# EAGLE design LokomotivRevB (EAGLE 6.4)
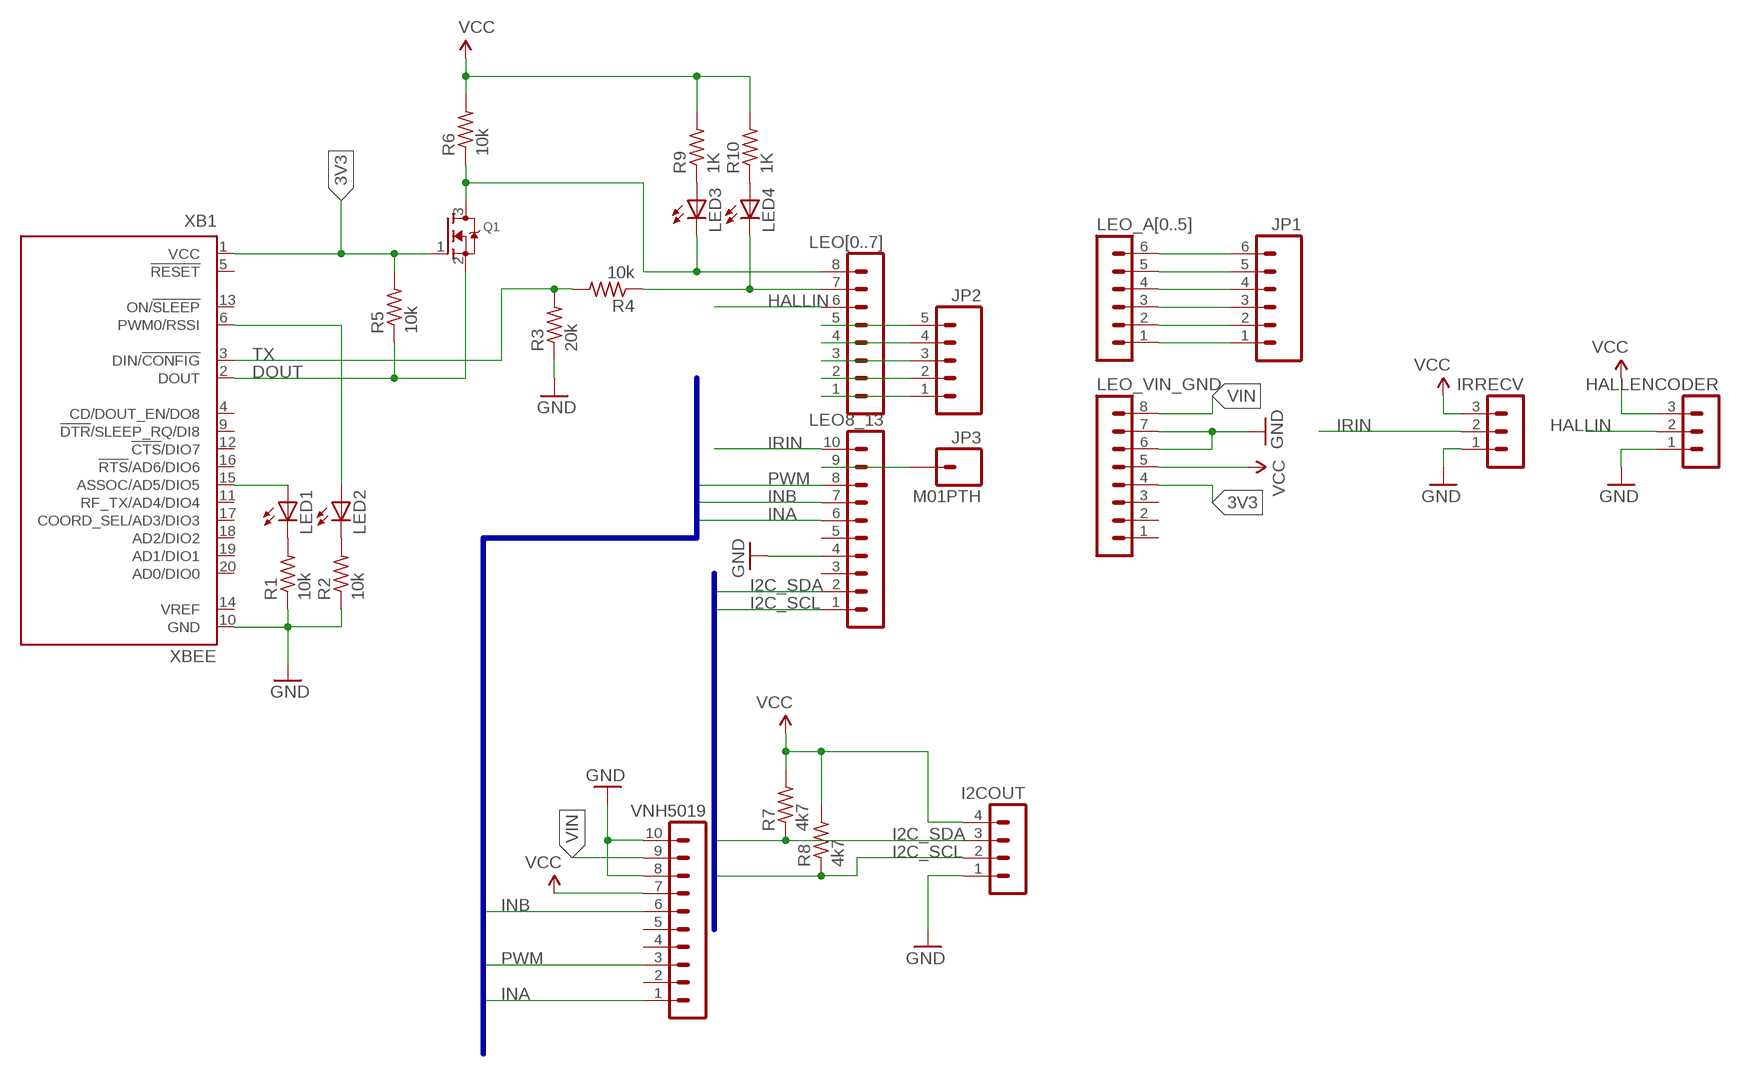
[diagram p0: schematic, sheet 1]

## Parts
HALLENCODER  MA03-1  [MA03-1]
I2COUT  MA04-1  [MA04-1]
IRRECV  MA03-1  [MA03-1]
JP1  M06SIP  [1X06]
JP2  M05PTH  [1X05]
JP3  M01PTH  [1X01]
LED1  LEDCHIP-LED0805  [CHIP-LED0805]
LED2  LEDCHIP-LED0805  [CHIP-LED0805]
LED3  LEDCHIP-LED0805  [CHIP-LED0805]
LED4  LEDCHIP-LED0805  [CHIP-LED0805]
LEO8_13  MA10-1  [MA10-1]
LEO[0..7]  MA08-1  [MA08-1]
LEO_A[0..5]  MA06-1  [MA06-1]
LEO_VIN_GND  MA08-1  [MA08-1]
Q1  MOSFET-NREFLOW  [SOT23]
R1  10k  R-US_R0805  [R0805]
R2  10k  R-US_R0805  [R0805]
R3  20k  R-US_R0805  [R0805]
R4  10k  R-US_R0805  [R0805]
R5  10k  R-US_R0805  [R0805]
R6  10k  R-US_R0805  [R0805]
R7  4k7  R-US_R0805  [R0805]
R8  4k7  R-US_R0805  [R0805]
R9  1K  R-US_R0805  [R0805]
R10  1K  R-US_R0805  [R0805]
VNH5019  MA10-1  [MA10-1]
XB1  XBEE  [XBEE]

## Nets
3V3: LEO_VIN_GND.4 Q1.1(G) R5.2 XB1.1(VCC)
DOUT: Q1.2(S) R5.1 XB1.2(DOUT)
GND: HALLENCODER.1 I2COUT.1 IRRECV.1 LEO8_13.4 LEO_VIN_GND.6 LEO_VIN_GND.7 R1.1 R2.1 R3.1 VNH5019.8 VNH5019.10 XB1.10(GND)
HALLIN: HALLENCODER.2 LEO[0..7].6
I2C_SCL: I2COUT.2 LEO8_13.1 R8.1
I2C_SDA: I2COUT.3 LEO8_13.2 R7.1
INA: LEO8_13.6 VNH5019.1
INB: LEO8_13.7 VNH5019.6
IRIN: IRRECV.2 LEO8_13.10
N$1: LED1.C R1.2
N$2: LED2.C R2.2
N$3: LED1.A XB1.15(ASSOC/AD5/DIO5)
N$4: LED2.A XB1.6(PWM0/RSSI)
N$5: LED3.C LEO[0..7].8 Q1.3(D) R6.1
N$6: LED3.A R9.1
N$7: LED4.A R10.1
N$8: JP1.6 LEO_A[0..5].6
N$9: LED4.C LEO[0..7].7 R4.1
N$10: JP1.5 LEO_A[0..5].5
N$11: JP1.4 LEO_A[0..5].4
N$12: JP1.3 LEO_A[0..5].3
N$13: JP1.2 LEO_A[0..5].2
N$14: JP1.1 LEO_A[0..5].1
N$15: JP2.5 LEO[0..7].5
N$16: JP2.4 LEO[0..7].4
N$17: JP2.3 LEO[0..7].3
N$18: JP2.2 LEO[0..7].2
N$19: JP2.1 LEO[0..7].1
N$20: JP3.1 LEO8_13.9
PWM: LEO8_13.8 VNH5019.3
TX: R3.2 R4.2 XB1.3(DIN/!CONFIG)
VCC: HALLENCODER.3 I2COUT.4 IRRECV.3 LEO_VIN_GND.5 R6.2 R7.2 R8.2 R9.2 R10.2 VNH5019.7
VIN: LEO_VIN_GND.8 VNH5019.9
Unconnected: LEO8_13.3 LEO8_13.5 LEO_VIN_GND.1 LEO_VIN_GND.2 LEO_VIN_GND.3 VNH5019.2 VNH5019.4 VNH5019.5 XB1.4(CD/DOUT_EN/DO8) XB1.5(!RESET) XB1.9(!DTR!/SLEEP_RQ/DI8) XB1.11(RF_TX/AD4/DIO4) XB1.12(!CTS!/DIO7) XB1.13(ON/!SLEEP) XB1.14(VREF) XB1.16(!RTS!/AD6/DIO6) XB1.17(COORD_SEL/AD3/DIO3) XB1.18(AD2/DIO2) XB1.19(AD1/DIO1) XB1.20(AD0/DIO0)

## Buses
I2C_SDA,I2C_SCL
INA,INB,PWM,ENDIAG

## Library data of the parts
HALLENCODER IRRECV = con-lstb:MA03-1: PIN HEADER; OC_FARNELL: unknown; OC_NEWARK: unknown
I2COUT = con-lstb:MA04-1: PIN HEADER; OC_FARNELL: unknown; OC_NEWARK: unknown
JP1 = SparkFun-Connectors:M06: Header 6 Standard 6-pin 0.1" header. Use with straight break away headers (SKU : PRT-00116), right angle break away headers (PRT-00553), swiss pins (PRT-00743), machine pins (PRT-00117), and female headers (PRT-00115). Molex polarized connector foot print use with SKU : PRT-08094 with associated crimp pins and housings. NOTES ON THE VARIANTS LOCK and LOCK_LONGPADS... This footprint was designed to help hold the alignment of a through-hole component (i.e. 6-pin header) while soldering it into place. You may notice that each hole has been shifted either up or down by 0.005 of an inch from it's more standard position (which is a perfectly straight line). This slight alteration caused the pins (the squares in the middle) to touch the edges of the holes. Because they are alternating, it causes a "brace" to hold the component in place. 0.005 has proven to be the perfect amount of "off-center" position when using our standard breakaway headers. Although looks a little odd when you look at the bare footprint, once you have a header in there, the alteration is very hard to notice. Also,if you push a header all the way into place, it is covered up entirely on the bottom side. This idea of altering the position of holes to aid alignment will be further integrated into the Sparkfun Library for other footprints. It can help hold any component with 3 or more connection pins.
JP2 = SparkFun-Connectors:M05: Header 5 Standard 5-pin 0.1" header. Use with straight break away headers (SKU : PRT-00116), right angle break away headers (PRT-00553), swiss pins (PRT-00743), machine pins (PRT-00117), and female headers (PRT-00115). Molex polarized connector foot print use with SKU : PRT-08230 with associated crimp pins and housings.
JP3 = SparkFun-Connectors:M01: Header 1 Standard 1-pin 0.1" header. Use with straight break away headers (SKU : PRT-00116), right angle break away headers (PRT-00553), swiss pins (PRT-00743), machine pins (PRT-00117), and female headers (PRT-00115).
LED1-LED4 = adafruit:LED: LED OSRAM: - CHIPLED LG R971, LG N971, LY N971, LG Q971, LY Q971, LO R971, LY R971 LH N974, LH R974 LS Q976, LO Q976, LY Q976 LO Q996 - Hyper CHIPLED LW Q18S LB Q993, LB Q99A, LB R99A - SideLED LS A670, LO A670, LY A670, LG A670, LP A670 LB A673, LV A673, LT A673, LW A673 LH A674 LY A675 LS A676, LA A676, LO A676, LY A676, LW A676 LS A679, LY A679, LG A679 - Hyper Micro SIDELED® LS Y876, LA Y876, LO Y876, LY Y876 LT Y87S - SmartLED LW L88C, LW L88S LB L89C, LB L89S, LG L890 LS L89K, LO L89K, LY L89K LS L896, LA L896, LO L896, LY L896 - TOPLED LS T670, LO T670, LY T670, LG T670, LP T670 LSG T670, LSP T670, LSY T670, LOP T670, LYG T670 LG T671, LOG T671, LSG T671 LB T673, LV T673, LT T673, LW T673 LH T674 LS T676, LA T676, LO T676, LY T676, LB T676, LH T676, LSB T676, LW T676 LB T67C, LV T67C, LT T67C, LS T67K, LO T67K, LY T67K, LW E67C LS E67B, LA E67B, LO E67B, LY E67B, LB E67C, LV E67C, LT E67C LW T67C LS T679, LY T679, LG T679 LS T770, LO T770, LY T770, LG T770, LP T770 LB T773, LV T773, LT T773, LW T773 LH T774 LS E675, LA E675, LY E675, LS T675 LS T776, LA T776, LO T776, LY T776, LB T776 LHGB T686 LT T68C, LB T68C - Hyper Mini TOPLED® LB M676 - Mini TOPLED Santana® LG M470 LS M47K, LO M47K, LY M47K Source: http://www.osram.convergy.de/
LEO8_13 VNH5019 = con-lstb:MA10-1: PIN HEADER; OC_FARNELL: unknown; OC_NEWARK: unknown
LEO[0..7] LEO_VIN_GND = con-lstb:MA08-1: PIN HEADER; OC_FARNELL: unknown; OC_NEWARK: unknown
LEO_A[0..5] = con-lstb:MA06-1: PIN HEADER; OC_FARNELL: unknown; OC_NEWARK: unknown
Q1 = adafruit:MOSFET-N: N-Channel Mosfet 2N7002E - 60V 260mA SOT23 [Digikey: 2N7002ET1GOSTR-ND] - REEL BSH103 - 30V 850mA SOT23 [Digikey: 568-5013-1-ND]
R1-R10 = adafruit:R-US_: RESISTOR, American symbol
XB1 = maxstream:XBEE: XBee (TM) /XBee-PRO(TM) OEM RF Modules Source: MaxStream, Inc. xbee_productmanual.pdf; MPN: XBP24-Z7UIT-004; OC_FARNELL: 1751799; OC_NEWARK: 34R5507

## Net classes
0 Default: width 0.406 mm, drill 0.381 mm, clearance 1.016 mm

## Board
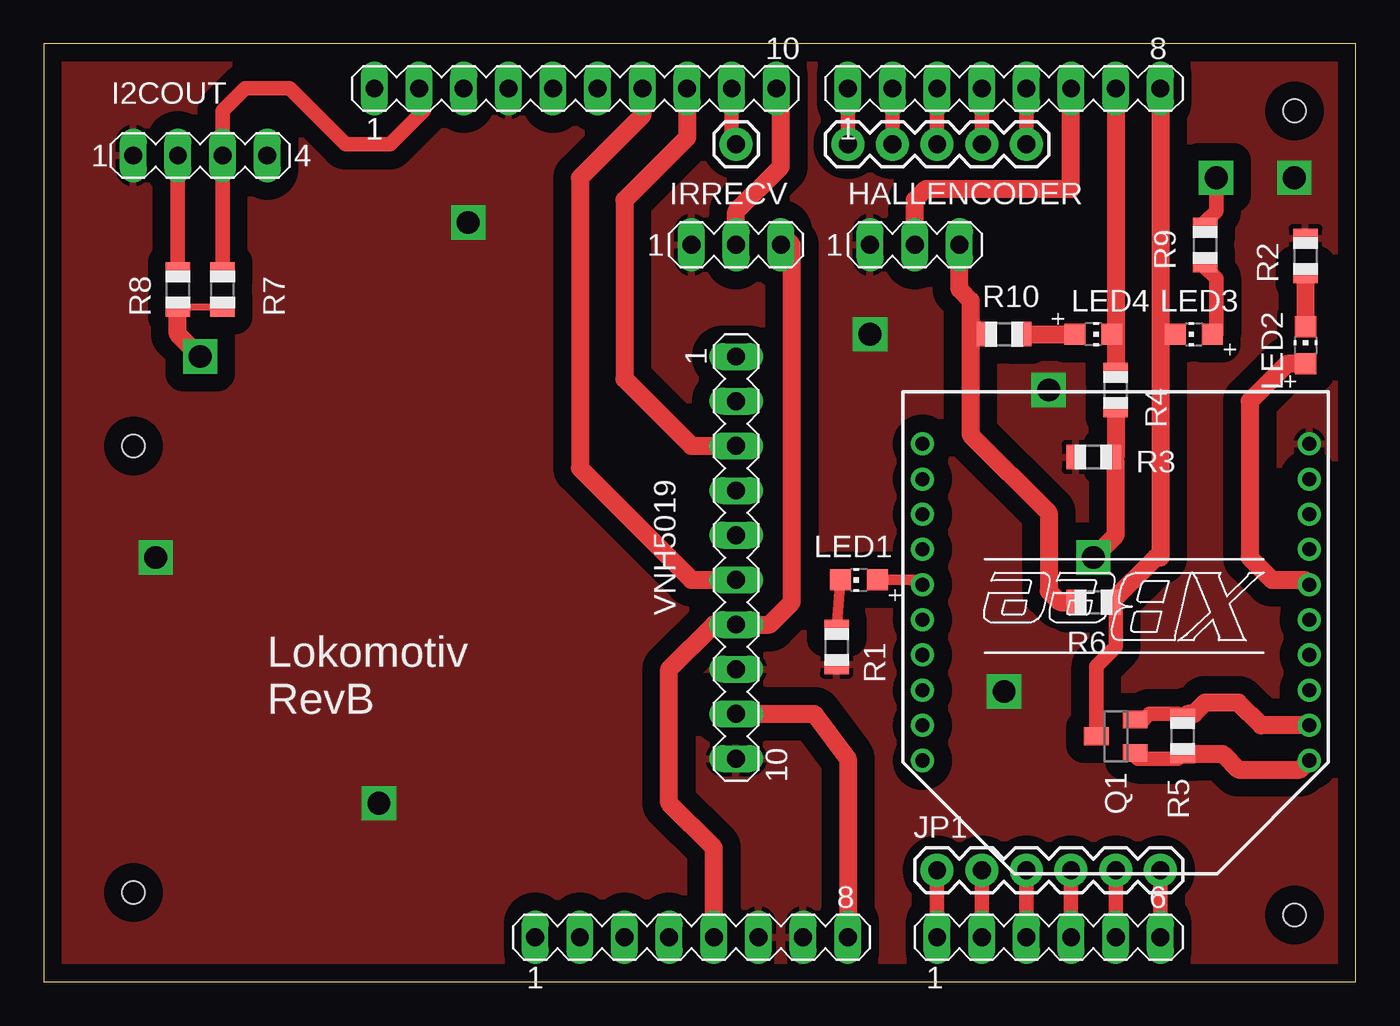
[diagram p1: board, top side]
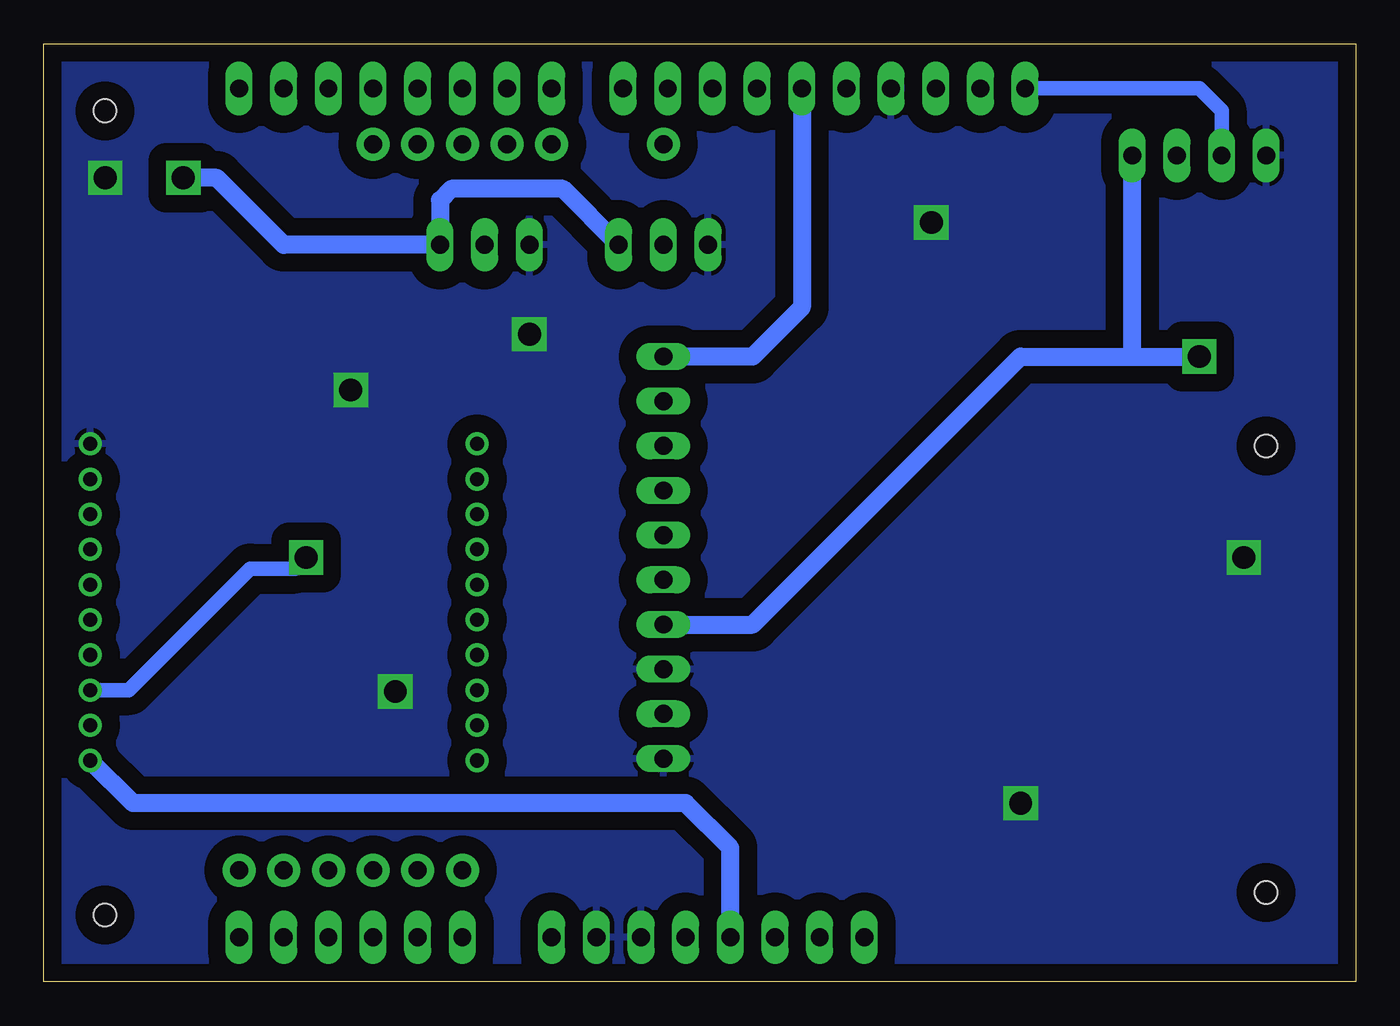
[diagram p2: board, bottom side, seen from below]

Size 74.6 x 53.33 mm. Coordinates in mm from the lower left corner, seen from the top.
Outline: 0,0 74.6,0 74.6,53.33 0,53.33 0,0
Copper layers (1*16): Top 0.035mm / dielectric 1.5mm / Bottom 0.035mm
Design rules "default": minimum track width 10mil, minimum drill 24mil, track to track 8mil, track to pad 8mil, pad to pad 8mil, via to via 8mil, smd to smd 8mil, copper to edge 40mil, drill to drill 8mil, minimum pad ring 10mil, minimum via ring 8mil, stop-mask expansion 4mil, vias tented up to drill 0mil, thermal gap 10mil
Holes 1.3 mm at 5.08,5.08 5.08,30.48 71.12,49.53 71.12,3.81

### Footprints (pad centres in the part's own frame; a part is rotated, then mirrored left to right if it is on the bottom)
MA03-1 = drill 1.016 long: 1 -2.54,0; 2 0,0; 3 2.54,0
MA04-1 = drill 1.016 long: 1 -3.81,0; 2 -1.27,0; 3 1.27,0; 4 3.81,0
1X06 = drill 1.016 pad 1.88: 1 0,0; 2 2.54,0; 3 5.08,0; 4 7.62,0; 5 10.16,0; 6 12.7,0
1X05 = drill 1.016 pad 1.88: 1 0,0; 2 2.54,0; 3 5.08,0; 4 7.62,0; 5 10.16,0
1X01 = drill 1.016 pad 1.88: 1 0,0
CHIP-LED0805 = smd 1.2 x 1.2: A 0,-1.05; C 0,1.05
MA10-1 = drill 1.016 long: 1 -11.43,0; 2 -8.89,0; 3 -6.35,0; 4 -3.81,0; 5 -1.27,0; 6 1.27,0; 7 3.81,0; 8 6.35,0; 9 8.89,0; 10 11.43,0
MA08-1 = drill 1.016 long: 1 -8.89,0; 2 -6.35,0; 3 -3.81,0; 4 -1.27,0; 5 1.27,0; 6 3.81,0; 7 6.35,0; 8 8.89,0
MA06-1 = drill 1.016 long: 1 -6.35,0; 2 -3.81,0; 3 -1.27,0; 4 1.27,0; 5 3.81,0; 6 6.35,0
SOT23 = smd 1 x 1.4: 1 -0.95,-1.1; 2 0.95,-1.1; 3 0,1.1
R0805 = smd 1.1 x 1.4: 1 -1,0; 2 1,0
XBEE = drill 0.8 pad 1.27: 1 -11,9; 2 -11,7; 3 -11,5; 4 -11,3; 5 -11,1; 6 -11,-1; 7 -11,-3; 8 -11,-5; 9 -11,-7; 10 -11,-9; 11 11,-9; 12 11,-7; 13 11,-5; 14 11,-3; 15 11,-1; 16 11,1; 17 11,3; 18 11,5; 19 11,7; 20 11,9

### Placement (x,y rotation side)
HALLENCODER  49.53,41.91 0 top
I2COUT  8.89,46.99 0 top
IRRECV  39.37,41.91 0 top
JP1  50.8,6.35 0 top
JP2  45.72,47.62 0 top
JP3  39.37,47.62 0 top
LED1  46.35,22.86 90 top
LED2  71.75,36.2 0 top
LED3  65.41,36.83 90 top
LED4  59.69,36.83 270 top
LEO8_13  30.23,50.8 0 top
LEO[0..7]  54.61,50.8 0 top
LEO_A[0..5]  57.15,2.54 0 top
LEO_VIN_GND  36.83,2.54 0 top
Q1  60.96,13.97 90 top
R1  45.09,19.05 90 top
R2  71.75,41.27 270 top
R3  59.69,29.84 0 top
R4  60.96,33.66 270 top
R5  64.77,13.97 270 top
R6  59.69,21.59 180 top
R7  10.16,39.37 270 top
R8  7.62,39.37 270 top
R9  66.04,41.91 90 top
R10  54.61,36.83 180 top
VNH5019  39.37,24.13 270 top
XB1  60.96,21.59 180 top

### Tracks (layer width: path | path; a pad name or v marks a point on that pad's centre or on a via)
3V3
  Top 0.406: 64.72,13.02 R5.2
  Top 0.813: Q1.1 62.06,12.87 62.23,12.7 64.5,12.7 R5.2
  Top 1.016: R5.2 67.04,12.97 67.94,12.06 71.44,12.06 XB1.1
  Bottom 1.016: LEO_VIN_GND.4 35.56,7.62 38.1,10.16 69.53,10.16 XB1.1
DOUT
  Top 0.406: 64.72,14.92 R5.1
  Top 0.813: Q1.2 62.55,14.92 62.87,15.24 64.5,15.24 R5.1
  Top 1.016: XB1.2 69.23,14.59 67.94,15.88 66.04,15.88 65.41,15.24 65.04,15.24 R5.1
GND  (via drill 1.3)
  other vias: 57.15,33.66 6.35,24.13 19.05,10.16 24.13,43.18 54.61,16.51 46.99,36.83 71.12,45.72
  pour Bottom: -1.27,53.34 -1.27,0 76.2,0 76.2,54.61 -1.27,54.61
  pour Top: 0,53.34 74.93,53.34 74.93,50.8 74.93,0 0,0
HALLIN
  Top 1.016: HALLENCODER.2 49.53,44.45 50.16,45.09 58.42,45.09 LEO[0..7].6
I2C_SCL
  Top 0.813: R8.1 I2COUT.2
  Bottom 0.813: LEO8_13.1 8.89,50.8 7.62,49.53 I2COUT.2
I2C_SDA
  Top 0.813: R7.1 I2COUT.3 10.16,49.53 11.43,50.8 13.97,50.8 17.14,47.62 19.68,47.62 21.59,49.53 21.59,50.55 LEO8_13.2
INA
  Bottom 1.016: LEO8_13.6 31.5,38.35 34.29,35.56 VNH5019.1
INB
  Top 1.016: LEO8_13.7 34.04,49.28 30.48,45.72 30.48,29.21 36.83,22.86 VNH5019.6
IRIN
  Top 1.016: IRRECV.2 39.37,43.81 41.91,46.35 41.91,50.55 LEO8_13.10
N$1
  Top 0.61: LED1.C R1.2
N$2
  Top 1.016: R2.2 LED2.C
N$3
  Top 0.61: LED1.A 49.69,22.86 XB1.15
N$4
  Top 1.016: LED2.A 70.7,35.15 68.58,33.02 68.58,24.13 69.85,22.86 71.69,22.86 XB1.6
N$5
  Top 0.61: LED3.C 63.5,36.83
  Top 0.813: Q1.3 59.86,17.95 60.96,19.05 60.96,21.32 R6.1
  Top 1.016: LEO[0..7].8 63.5,36.83 63.5,24.13 63.23,24.13 R6.1
N$6
  Top 0.813: R9.1 66.04,40.64 66.67,40.01 66.67,36.83 LED3.A
N$7
  Top 1.016: R10.1 LED4.A
N$8
  Top 0.813: LEO_A[0..5].6 JP1.6
N$9
  Top 1.016: LEO[0..7].7 60.96,36.83 | LED4.C 60.96,36.83 | 60.96,36.83 R4.1
N$10
  Top 0.813: LEO_A[0..5].5 JP1.5
N$11
  Top 0.813: LEO_A[0..5].4 JP1.4
N$12
  Top 0.813: LEO_A[0..5].3 JP1.3
N$13
  Top 0.813: LEO_A[0..5].2 JP1.2
N$14
  Top 0.813: LEO_A[0..5].1 JP1.1
N$15
  Top 0.813: LEO[0..7].5 JP2.5
N$16
  Top 0.813: LEO[0..7].4 JP2.4
N$17
  Top 0.813: LEO[0..7].3 JP2.3
N$18
  Top 0.813: LEO[0..7].2 JP2.2
N$19
  Top 0.813: LEO[0..7].1 JP2.1
N$20
  Top 0.813: LEO8_13.9 39.12,47.88 JP3.1
PWM
  Top 1.016: LEO8_13.8 36.58,48.01 33.02,44.45 33.02,34.29 36.83,30.48 VNH5019.3
TX  (via drill 1.3)
  Top 1.016: R4.2 60.96,29.84 R3.2 60.96,29.57 60.96,25.4 v59.69,24.13
  Bottom 0.813: XB1.3 69.77,16.59 62.87,23.5 60.33,23.5 v59.69,24.13
VCC  (via drill 1.3)
  Top 0.406: R7.2 R8.2
  Top 0.813: R9.2 66.04,43.18 66.67,43.81 v66.67,45.72
  Top 1.016: R6.2 57.78,21.59 57.15,22.23 57.15,26.67 52.7,31.11 52.7,37.47 | v8.89,35.56 7.62,36.83 R8.2 | 52.7,37.47 52.7,38.73 52.07,39.37 HALLENCODER.3 | 52.7,37.47 53.34,36.83 R10.2 | LEO_VIN_GND.5 38.1,7.62 35.56,10.16 35.56,17.78 38.1,20.32 VNH5019.7 41.27,20.32 42.55,21.59 42.55,41.91 41.91,42.55 IRRECV.3
  Bottom 1.016: 12.7,35.56 I2COUT.4 | IRRECV.3 45.09,45.09 51.44,45.09 52.07,44.45 HALLENCODER.3 60.96,41.91 64.77,45.72 v66.67,45.72 | 12.7,35.56 v8.89,35.56 | VNH5019.7 34.29,20.32 19.05,35.56 12.7,35.56
VIN
  Top 1.016: VNH5019.9 43.81,15.24 45.72,12.7 LEO_VIN_GND.8

### Text on the board
tNames: Lokomotiv / RevB